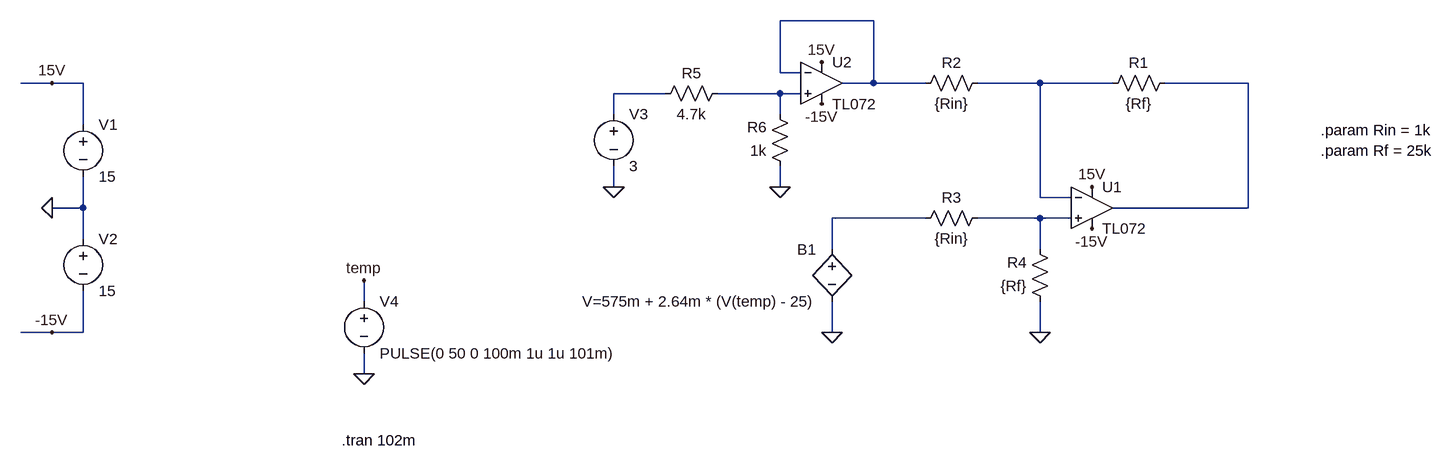
[diagram p0: schematic 200_temperature_sensor.asc]
200_temperature_sensor.asc, the LTspice schematic file:
Version 4
SHEET 1 1212 680
WIRE 336 -208 192 -208
WIRE 192 -128 192 -208
WIRE 224 -128 192 -128
WIRE -928 -112 -976 -112
WIRE -880 -112 -928 -112
WIRE 336 -112 336 -208
WIRE 336 -112 288 -112
WIRE 416 -112 336 -112
WIRE 592 -112 496 -112
WIRE 704 -112 592 -112
WIRE 912 -112 784 -112
WIRE 16 -96 -64 -96
WIRE 192 -96 96 -96
WIRE 224 -96 192 -96
WIRE -64 -64 -64 -96
WIRE 192 -64 192 -96
WIRE -880 -48 -880 -112
WIRE -64 48 -64 16
WIRE 192 48 192 16
WIRE 592 64 592 -112
WIRE 640 64 592 64
WIRE -880 80 -880 32
WIRE -880 80 -928 80
WIRE 912 80 912 -112
WIRE 912 80 704 80
WIRE 416 96 272 96
WIRE 592 96 496 96
WIRE 640 96 592 96
WIRE -880 128 -880 80
WIRE 272 144 272 96
WIRE 592 144 592 96
WIRE -448 224 -448 192
WIRE -928 272 -976 272
WIRE -880 272 -880 208
WIRE -880 272 -928 272
WIRE 272 272 272 224
WIRE 592 272 592 224
WIRE -448 336 -448 304
FLAG -928 80 0
FLAG -928 -112 15V
FLAG -928 272 -15V
FLAG 672 48 15V
FLAG 672 112 -15V
FLAG 272 272 0
FLAG -448 336 0
FLAG -448 192 temp
FLAG -64 48 0
FLAG 592 272 0
FLAG 256 -144 15V
FLAG 256 -80 -15V
FLAG 192 48 0
SYMBOL voltage -880 -64 R0
WINDOW 123 0 0 Left 0
WINDOW 39 0 0 Left 0
SYMATTR InstName V1
SYMATTR Value 15
SYMBOL voltage -880 112 R0
WINDOW 123 0 0 Left 0
WINDOW 39 0 0 Left 0
SYMATTR InstName V2
SYMATTR Value 15
SYMBOL ZZZ\\OpAmp\\TL072 672 80 R0
SYMATTR InstName U1
SYMBOL voltage -448 208 R0
WINDOW 123 0 0 Left 0
WINDOW 39 0 0 Left 0
SYMATTR InstName V4
SYMATTR Value PULSE(0 50 0 100m 1u 1u 101m)
SYMBOL bv 272 128 M0
SYMATTR InstName B1
SYMATTR Value V=575m + 2.64m * (V(temp) - 25)
SYMBOL res 800 -128 R90
WINDOW 0 0 56 VBottom 2
WINDOW 3 32 56 VTop 2
SYMATTR InstName R1
SYMATTR Value {Rf}
SYMBOL res 512 -128 R90
WINDOW 0 0 56 VBottom 2
WINDOW 3 32 56 VTop 2
SYMATTR InstName R2
SYMATTR Value {Rin}
SYMBOL voltage -64 -80 R0
WINDOW 123 0 0 Left 0
WINDOW 39 0 0 Left 0
SYMATTR InstName V3
SYMATTR Value 3
SYMBOL res 512 80 R90
WINDOW 0 0 56 VBottom 2
WINDOW 3 32 56 VTop 2
SYMATTR InstName R3
SYMATTR Value {Rin}
SYMBOL res 608 240 R180
WINDOW 0 36 76 Left 2
WINDOW 3 36 40 Left 2
SYMATTR InstName R4
SYMATTR Value {Rf}
SYMBOL ZZZ\\OpAmp\\TL072 256 -112 R0
SYMATTR InstName U2
SYMBOL res 112 -112 R90
WINDOW 0 0 56 VBottom 2
WINDOW 3 32 56 VTop 2
SYMATTR InstName R5
SYMATTR Value 4.7k
SYMBOL res 208 32 R180
WINDOW 0 36 76 Left 2
WINDOW 3 36 40 Left 2
SYMATTR InstName R6
SYMATTR Value 1k
TEXT -482 438 Left 2 !.tran 102m
TEXT 1024 -40 Left 2 !.param Rin = 1k
TEXT 1024 -8 Left 2 !.param Rf = 25k

The netlist it stands for:
* 200_temperature_sensor.asc
V1 15V 0 15
V2 0 -15V 15
* U1: TL072 (symbol ZZZ\OpAmp\TL072 not available, pins judged from their places): In+=N007 In-=N002 V+=15V V-=-15V OUT=N003
V4 temp 0 PULSE(0 50 0 100m 1u 1u 101m)
B1 N006 0 V=575m + 2.64m * (V(temp) - 25)
R1 N003 N002 {Rf}
R2 N002 N001 {Rin}
V3 N004 0 3
R3 N007 N006 {Rin}
R4 0 N007 {Rf}
* U2: TL072 (symbol ZZZ\OpAmp\TL072 not available, pins judged from their places): In+=N005 In-=N001 V+=15V V-=-15V OUT=N001
R5 N005 N004 4.7k
R6 0 N005 1k
.tran 102m
.param Rin = 1k
.param Rf = 25k
.backanno
.end